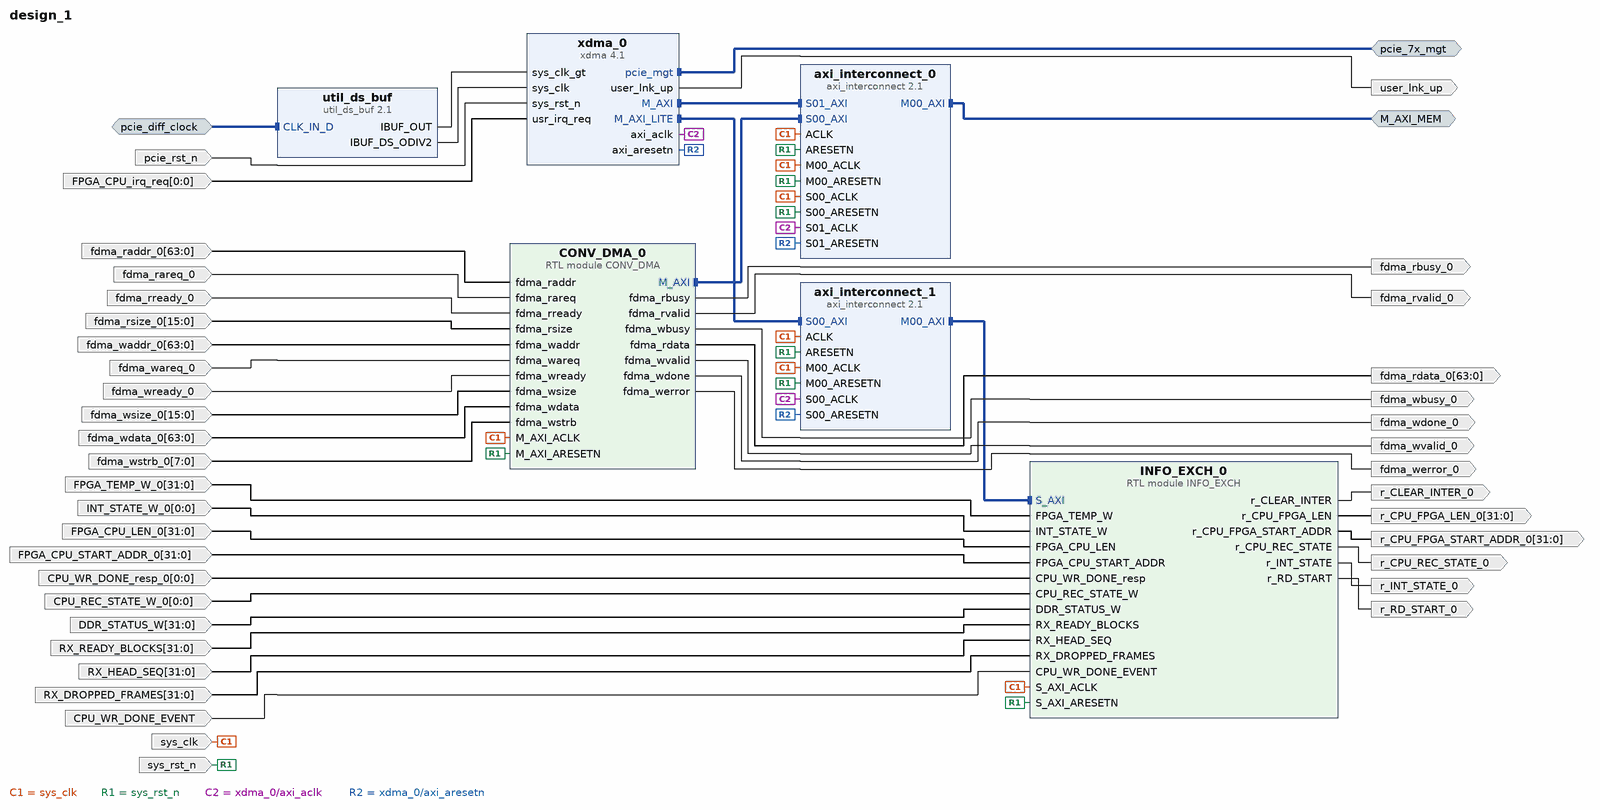
[diagram p0: block diagram of the top level]
# Vivado block design design_1, xcku040-ffva1156-2-i, Vivado 2020.2
create_bd_design design_1

create_bd_intf_port -mode Master -vlnv xilinx.com:interface:pcie_7x_mgt_rtl:1.0 pcie_7x_mgt
create_bd_intf_port -mode Slave -vlnv xilinx.com:interface:diff_clock_rtl:1.0 pcie_diff_clock
set_property -dict {CONFIG.FREQ_HZ 100000000} [get_bd_intf_ports pcie_diff_clock]
create_bd_intf_port -mode Master -vlnv xilinx.com:interface:aximm_rtl:1.0 M_AXI_MEM
set_property -dict [list \
  CONFIG.ADDR_WIDTH 32 \
  CONFIG.DATA_WIDTH 64 \
  CONFIG.FREQ_HZ 250000000 \
  CONFIG.HAS_BURST 1 \
  CONFIG.HAS_CACHE 1 \
  CONFIG.HAS_LOCK 1 \
  CONFIG.HAS_PROT 1 \
  CONFIG.HAS_QOS 1 \
  CONFIG.HAS_REGION 0 \
  CONFIG.NUM_READ_OUTSTANDING 16 \
  CONFIG.NUM_WRITE_OUTSTANDING 16 \
  CONFIG.PROTOCOL AXI4 \
] [get_bd_intf_ports M_AXI_MEM]
create_bd_port -dir I -type clk sys_clk
set_property -dict {CONFIG.FREQ_HZ 250000000} [get_bd_ports sys_clk]
create_bd_port -dir I -type rst sys_rst_n
create_bd_port -dir I -from 63 -to 0 fdma_raddr_0
create_bd_port -dir I fdma_rareq_0
create_bd_port -dir O fdma_rbusy_0
create_bd_port -dir I fdma_rready_0
create_bd_port -dir I -from 15 -to 0 fdma_rsize_0
create_bd_port -dir O fdma_rvalid_0
create_bd_port -dir I -from 63 -to 0 fdma_waddr_0
create_bd_port -dir I fdma_wareq_0
create_bd_port -dir O fdma_wbusy_0
create_bd_port -dir I fdma_wready_0
create_bd_port -dir I -from 15 -to 0 fdma_wsize_0
create_bd_port -dir O fdma_wvalid_0
create_bd_port -dir O -from 63 -to 0 fdma_rdata_0
create_bd_port -dir I -from 63 -to 0 fdma_wdata_0
create_bd_port -dir I -type rst pcie_rst_n
set_property -dict {CONFIG.POLARITY ACTIVE_LOW} [get_bd_ports pcie_rst_n]
create_bd_port -dir O user_lnk_up
create_bd_port -dir I -from 31 -to 0 FPGA_TEMP_W_0
create_bd_port -dir O r_CLEAR_INTER_0
create_bd_port -dir I -from 0 -to 0 INT_STATE_W_0
create_bd_port -dir O r_INT_STATE_0
create_bd_port -dir O r_RD_START_0
create_bd_port -dir I -from 31 -to 0 FPGA_CPU_LEN_0
create_bd_port -dir I -from 31 -to 0 FPGA_CPU_START_ADDR_0
create_bd_port -dir O -from 31 -to 0 r_CPU_FPGA_START_ADDR_0
create_bd_port -dir O -from 31 -to 0 r_CPU_FPGA_LEN_0
create_bd_port -dir I -from 0 -to 0 CPU_WR_DONE_resp_0
create_bd_port -dir I -from 0 -to 0 FPGA_CPU_irq_req
create_bd_port -dir O r_CPU_REC_STATE_0
create_bd_port -dir I -from 0 -to 0 CPU_REC_STATE_W_0
create_bd_port -dir I -from 31 -to 0 DDR_STATUS_W
create_bd_port -dir I -from 31 -to 0 RX_READY_BLOCKS
create_bd_port -dir I -from 31 -to 0 RX_HEAD_SEQ
create_bd_port -dir I -from 31 -to 0 RX_DROPPED_FRAMES
create_bd_port -dir O fdma_wdone_0
create_bd_port -dir O fdma_werror_0
create_bd_port -dir I -from 7 -to 0 fdma_wstrb_0
create_bd_port -dir I CPU_WR_DONE_EVENT

create_bd_cell -type ip -vlnv xilinx.com:ip:axi_interconnect:2.1 axi_interconnect_0
set_property -dict {CONFIG.NUM_MI 1 CONFIG.NUM_SI 2} [get_bd_cells axi_interconnect_0]
create_bd_cell -type ip -vlnv xilinx.com:ip:axi_interconnect:2.1 axi_interconnect_1
set_property -dict {CONFIG.NUM_MI 1 CONFIG.NUM_SI 1} [get_bd_cells axi_interconnect_1]
create_bd_cell -type ip -vlnv xilinx.com:ip:util_ds_buf:2.1 util_ds_buf
set_property -dict {CONFIG.C_BUF_TYPE IBUFDSGTE} [get_bd_cells util_ds_buf]
create_bd_cell -type ip -vlnv xilinx.com:ip:xdma:4.1 xdma_0
set_property -dict [list \
  CONFIG.PF0_DEVICE_ID_mqdma 9032 \
  CONFIG.PF2_DEVICE_ID_mqdma 9032 \
  CONFIG.PF3_DEVICE_ID_mqdma 9032 \
  CONFIG.axi_data_width 64_bit \
  CONFIG.axilite_master_en true \
  CONFIG.axisten_freq 250 \
  CONFIG.cfg_mgmt_if false \
  CONFIG.coreclk_freq 500 \
  CONFIG.pciebar2axibar_axil_master 0x40000000 \
  CONFIG.pf0_device_id 8032 \
  CONFIG.pf0_interrupt_pin NONE \
  CONFIG.pl_link_cap_max_link_speed 8.0_GT/s \
  CONFIG.pl_link_cap_max_link_width X2 \
  CONFIG.plltype QPLL1 \
  CONFIG.xdma_axi_intf_mm AXI_Memory_Mapped \
  CONFIG.xdma_num_usr_irq 1 \
  CONFIG.xdma_rnum_chnl 1 \
  CONFIG.xdma_wnum_chnl 1 \
] [get_bd_cells xdma_0]
create_bd_cell -type module -reference CONV_DMA CONV_DMA_0
set_property -dict {CONFIG.M_AXI_DATA_WIDTH 64} [get_bd_cells CONV_DMA_0]
create_bd_cell -type module -reference INFO_EXCH INFO_EXCH_0
set_property -dict {CONFIG.CH_BUF_LEN 0x00040000 CONFIG.PROG_TIME 0x20260914 CONFIG.VERSION 0x00002001} [get_bd_cells INFO_EXCH_0]

# ---- connections ----

connect_bd_intf_net [get_bd_intf_ports M_AXI_MEM] [get_bd_intf_pins axi_interconnect_0/M00_AXI]
connect_bd_intf_net [get_bd_intf_ports pcie_7x_mgt] [get_bd_intf_pins xdma_0/pcie_mgt]
connect_bd_intf_net [get_bd_intf_pins axi_interconnect_1/S00_AXI] [get_bd_intf_pins xdma_0/M_AXI_LITE]
connect_bd_intf_net [get_bd_intf_pins axi_interconnect_0/S01_AXI] [get_bd_intf_pins xdma_0/M_AXI]
connect_bd_intf_net [get_bd_intf_pins axi_interconnect_1/M00_AXI] [get_bd_intf_pins INFO_EXCH_0/S_AXI]
connect_bd_intf_net -intf_net diff_clock_rtl_0_1 [get_bd_intf_ports pcie_diff_clock] [get_bd_intf_pins util_ds_buf/CLK_IN_D]
connect_bd_intf_net [get_bd_intf_pins axi_interconnect_0/S00_AXI] [get_bd_intf_pins CONV_DMA_0/M_AXI]
connect_bd_net -net M_AXI_ACLK_0_1 [get_bd_ports sys_clk] \
  [get_bd_pins axi_interconnect_0/ACLK] [get_bd_pins axi_interconnect_0/S00_ACLK] [get_bd_pins axi_interconnect_0/M00_ACLK] \
  [get_bd_pins axi_interconnect_1/ACLK] [get_bd_pins axi_interconnect_1/M00_ACLK] [get_bd_pins CONV_DMA_0/M_AXI_ACLK] \
  [get_bd_pins INFO_EXCH_0/S_AXI_ACLK]
connect_bd_net -net M_AXI_ARESETN_0_1 [get_bd_ports sys_rst_n] \
  [get_bd_pins axi_interconnect_0/ARESETN] [get_bd_pins axi_interconnect_0/S00_ARESETN] \
  [get_bd_pins axi_interconnect_0/M00_ARESETN] [get_bd_pins axi_interconnect_1/ARESETN] \
  [get_bd_pins axi_interconnect_1/M00_ARESETN] [get_bd_pins CONV_DMA_0/M_AXI_ARESETN] [get_bd_pins INFO_EXCH_0/S_AXI_ARESETN]
connect_bd_net -net fdma_raddr_0_1 [get_bd_ports fdma_raddr_0] [get_bd_pins CONV_DMA_0/fdma_raddr]
connect_bd_net -net fdma_rareq_0_1 [get_bd_ports fdma_rareq_0] [get_bd_pins CONV_DMA_0/fdma_rareq]
connect_bd_net [get_bd_pins CONV_DMA_0/fdma_rbusy] [get_bd_ports fdma_rbusy_0]
connect_bd_net -net fdma_rready_0_1 [get_bd_ports fdma_rready_0] [get_bd_pins CONV_DMA_0/fdma_rready]
connect_bd_net -net fdma_rsize_0_1 [get_bd_ports fdma_rsize_0] [get_bd_pins CONV_DMA_0/fdma_rsize]
connect_bd_net [get_bd_pins CONV_DMA_0/fdma_rvalid] [get_bd_ports fdma_rvalid_0]
connect_bd_net -net fdma_waddr_0_1 [get_bd_ports fdma_waddr_0] [get_bd_pins CONV_DMA_0/fdma_waddr]
connect_bd_net -net fdma_wareq_0_1 [get_bd_ports fdma_wareq_0] [get_bd_pins CONV_DMA_0/fdma_wareq]
connect_bd_net [get_bd_pins CONV_DMA_0/fdma_wbusy] [get_bd_ports fdma_wbusy_0]
connect_bd_net -net fdma_wready_0_1 [get_bd_ports fdma_wready_0] [get_bd_pins CONV_DMA_0/fdma_wready]
connect_bd_net -net fdma_wsize_0_1 [get_bd_ports fdma_wsize_0] [get_bd_pins CONV_DMA_0/fdma_wsize]
connect_bd_net [get_bd_pins CONV_DMA_0/fdma_wvalid] [get_bd_ports fdma_wvalid_0]
connect_bd_net [get_bd_pins CONV_DMA_0/fdma_rdata] [get_bd_ports fdma_rdata_0]
connect_bd_net -net fdma_wdata_0_1 [get_bd_ports fdma_wdata_0] [get_bd_pins CONV_DMA_0/fdma_wdata]
connect_bd_net -net reset_rtl_0_1 [get_bd_ports pcie_rst_n] [get_bd_pins xdma_0/sys_rst_n]
connect_bd_net [get_bd_pins util_ds_buf/IBUF_OUT] [get_bd_pins xdma_0/sys_clk_gt]
connect_bd_net [get_bd_pins util_ds_buf/IBUF_DS_ODIV2] [get_bd_pins xdma_0/sys_clk]
connect_bd_net [get_bd_pins xdma_0/axi_aclk] [get_bd_pins axi_interconnect_0/S01_ACLK] [get_bd_pins axi_interconnect_1/S00_ACLK]
connect_bd_net [get_bd_pins xdma_0/axi_aresetn] [get_bd_pins axi_interconnect_0/S01_ARESETN] [get_bd_pins axi_interconnect_1/S00_ARESETN]
connect_bd_net [get_bd_pins xdma_0/user_lnk_up] [get_bd_ports user_lnk_up]
connect_bd_net -net FPGA_TEMP_W_0_1 [get_bd_ports FPGA_TEMP_W_0] [get_bd_pins INFO_EXCH_0/FPGA_TEMP_W]
connect_bd_net [get_bd_pins INFO_EXCH_0/r_CLEAR_INTER] [get_bd_ports r_CLEAR_INTER_0]
connect_bd_net -net INT_STATE_W_0_1 [get_bd_ports INT_STATE_W_0] [get_bd_pins INFO_EXCH_0/INT_STATE_W]
connect_bd_net [get_bd_pins INFO_EXCH_0/r_INT_STATE] [get_bd_ports r_INT_STATE_0]
connect_bd_net [get_bd_pins INFO_EXCH_0/r_RD_START] [get_bd_ports r_RD_START_0]
connect_bd_net -net FPGA_CPU_LEN_0_1 [get_bd_ports FPGA_CPU_LEN_0] [get_bd_pins INFO_EXCH_0/FPGA_CPU_LEN]
connect_bd_net -net FPGA_CPU_START_ADDR_0_1 [get_bd_ports FPGA_CPU_START_ADDR_0] [get_bd_pins INFO_EXCH_0/FPGA_CPU_START_ADDR]
connect_bd_net [get_bd_pins INFO_EXCH_0/r_CPU_FPGA_START_ADDR] [get_bd_ports r_CPU_FPGA_START_ADDR_0]
connect_bd_net [get_bd_pins INFO_EXCH_0/r_CPU_FPGA_LEN] [get_bd_ports r_CPU_FPGA_LEN_0]
connect_bd_net -net CPU_WR_DONE_resp_0_1 [get_bd_ports CPU_WR_DONE_resp_0] [get_bd_pins INFO_EXCH_0/CPU_WR_DONE_resp]
connect_bd_net [get_bd_pins INFO_EXCH_0/r_CPU_REC_STATE] [get_bd_ports r_CPU_REC_STATE_0]
connect_bd_net -net CPU_REC_STATE_W_0_1 [get_bd_ports CPU_REC_STATE_W_0] [get_bd_pins INFO_EXCH_0/CPU_REC_STATE_W]
connect_bd_net [get_bd_ports FPGA_CPU_irq_req] [get_bd_pins xdma_0/usr_irq_req]
connect_bd_net [get_bd_ports DDR_STATUS_W] [get_bd_pins INFO_EXCH_0/DDR_STATUS_W]
connect_bd_net -net RX_READY_BLOCKS_net [get_bd_ports RX_READY_BLOCKS] [get_bd_pins INFO_EXCH_0/RX_READY_BLOCKS]
connect_bd_net -net RX_HEAD_SEQ_net [get_bd_ports RX_HEAD_SEQ] [get_bd_pins INFO_EXCH_0/RX_HEAD_SEQ]
connect_bd_net -net RX_DROPPED_FRAMES_net [get_bd_ports RX_DROPPED_FRAMES] [get_bd_pins INFO_EXCH_0/RX_DROPPED_FRAMES]
connect_bd_net -net fdma_wdone_0_net [get_bd_pins CONV_DMA_0/fdma_wdone] [get_bd_ports fdma_wdone_0]
connect_bd_net -net fdma_werror_0_net [get_bd_pins CONV_DMA_0/fdma_werror] [get_bd_ports fdma_werror_0]
connect_bd_net -net fdma_wstrb_0_1 [get_bd_ports fdma_wstrb_0] [get_bd_pins CONV_DMA_0/fdma_wstrb]
connect_bd_net [get_bd_ports CPU_WR_DONE_EVENT] [get_bd_pins INFO_EXCH_0/CPU_WR_DONE_EVENT]

# ---- address map ----
assign_bd_address -offset 0x0000000000000000 -range 4M -target_address_space [get_bd_addr_spaces CONV_DMA_0/M_AXI] [get_bd_addr_segs M_AXI_MEM/Reg]
assign_bd_address -offset 0x0000000000000000 -range 4M -target_address_space [get_bd_addr_spaces xdma_0/M_AXI] [get_bd_addr_segs M_AXI_MEM/Reg]
assign_bd_address -offset 0x40000000 -range 4K -target_address_space [get_bd_addr_spaces xdma_0/M_AXI_LITE] [get_bd_addr_segs INFO_EXCH_0/S_AXI/reg0]

validate_bd_design
save_bd_design
